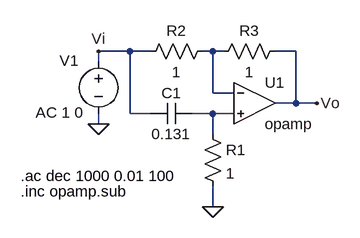
[diagram p0: schematic Pasatodo_Activo.asc]
Pasatodo_Activo.asc, the LTspice schematic file:
Version 4
SHEET 1 1328 680
WIRE 416 -16 368 -16
WIRE 448 -16 416 -16
WIRE 544 -16 528 -16
WIRE 560 -16 544 -16
WIRE 672 -16 640 -16
WIRE 368 0 368 -16
WIRE 544 48 544 -16
WIRE 576 48 544 48
WIRE 672 64 672 -16
WIRE 672 64 640 64
WIRE 704 64 672 64
WIRE 416 80 416 -16
WIRE 448 80 416 80
WIRE 544 80 512 80
WIRE 576 80 544 80
WIRE 368 96 368 80
WIRE 544 112 544 80
WIRE 544 224 544 192
FLAG 368 96 0
FLAG 368 -16 Vi
FLAG 704 64 Vo
FLAG 544 224 0
SYMBOL voltage 368 -16 R0
WINDOW 123 -97 94 Left 2
WINDOW 39 0 0 Left 0
WINDOW 0 -60 14 Left 2
SYMATTR Value2 AC 1 0
SYMATTR InstName V1
SYMATTR Value ""
SYMBOL Opamps\\opamp 608 0 R0
SYMATTR InstName U1
SYMATTR SpiceLine2 GBW=100Meg
SYMBOL res 528 96 R0
SYMATTR InstName R1
SYMATTR Value 1
SYMBOL cap 512 64 R90
WINDOW 0 0 32 VBottom 2
WINDOW 3 32 32 VTop 2
SYMATTR InstName C1
SYMATTR Value 0.131
SYMBOL res 544 -32 R90
WINDOW 0 0 56 VBottom 2
WINDOW 3 32 56 VTop 2
SYMATTR InstName R2
SYMATTR Value 1
SYMBOL res 656 -32 R90
WINDOW 0 0 56 VBottom 2
WINDOW 3 32 56 VTop 2
SYMATTR InstName R3
SYMATTR Value 1
TEXT 248 200 Left 2 !.inc opamp.sub
TEXT 248 176 Left 2 !.ac dec 1000 0.01 100

The netlist it stands for:
* Pasatodo_Activo.asc
V1 Vi 0 AC 1 0
XU1 N001 N002 Vo opamp Aol=100K GBW=100Meg  ; pins invin noninvin out
R1 N002 0 1
C1 N002 Vi 0.131
R2 N001 Vi 1
R3 Vo N001 1
.inc opamp.sub
.ac dec 1000 0.01 100
.backanno
.end